# EAGLE design Final Driver Concept (EAGLE 9.5.0)
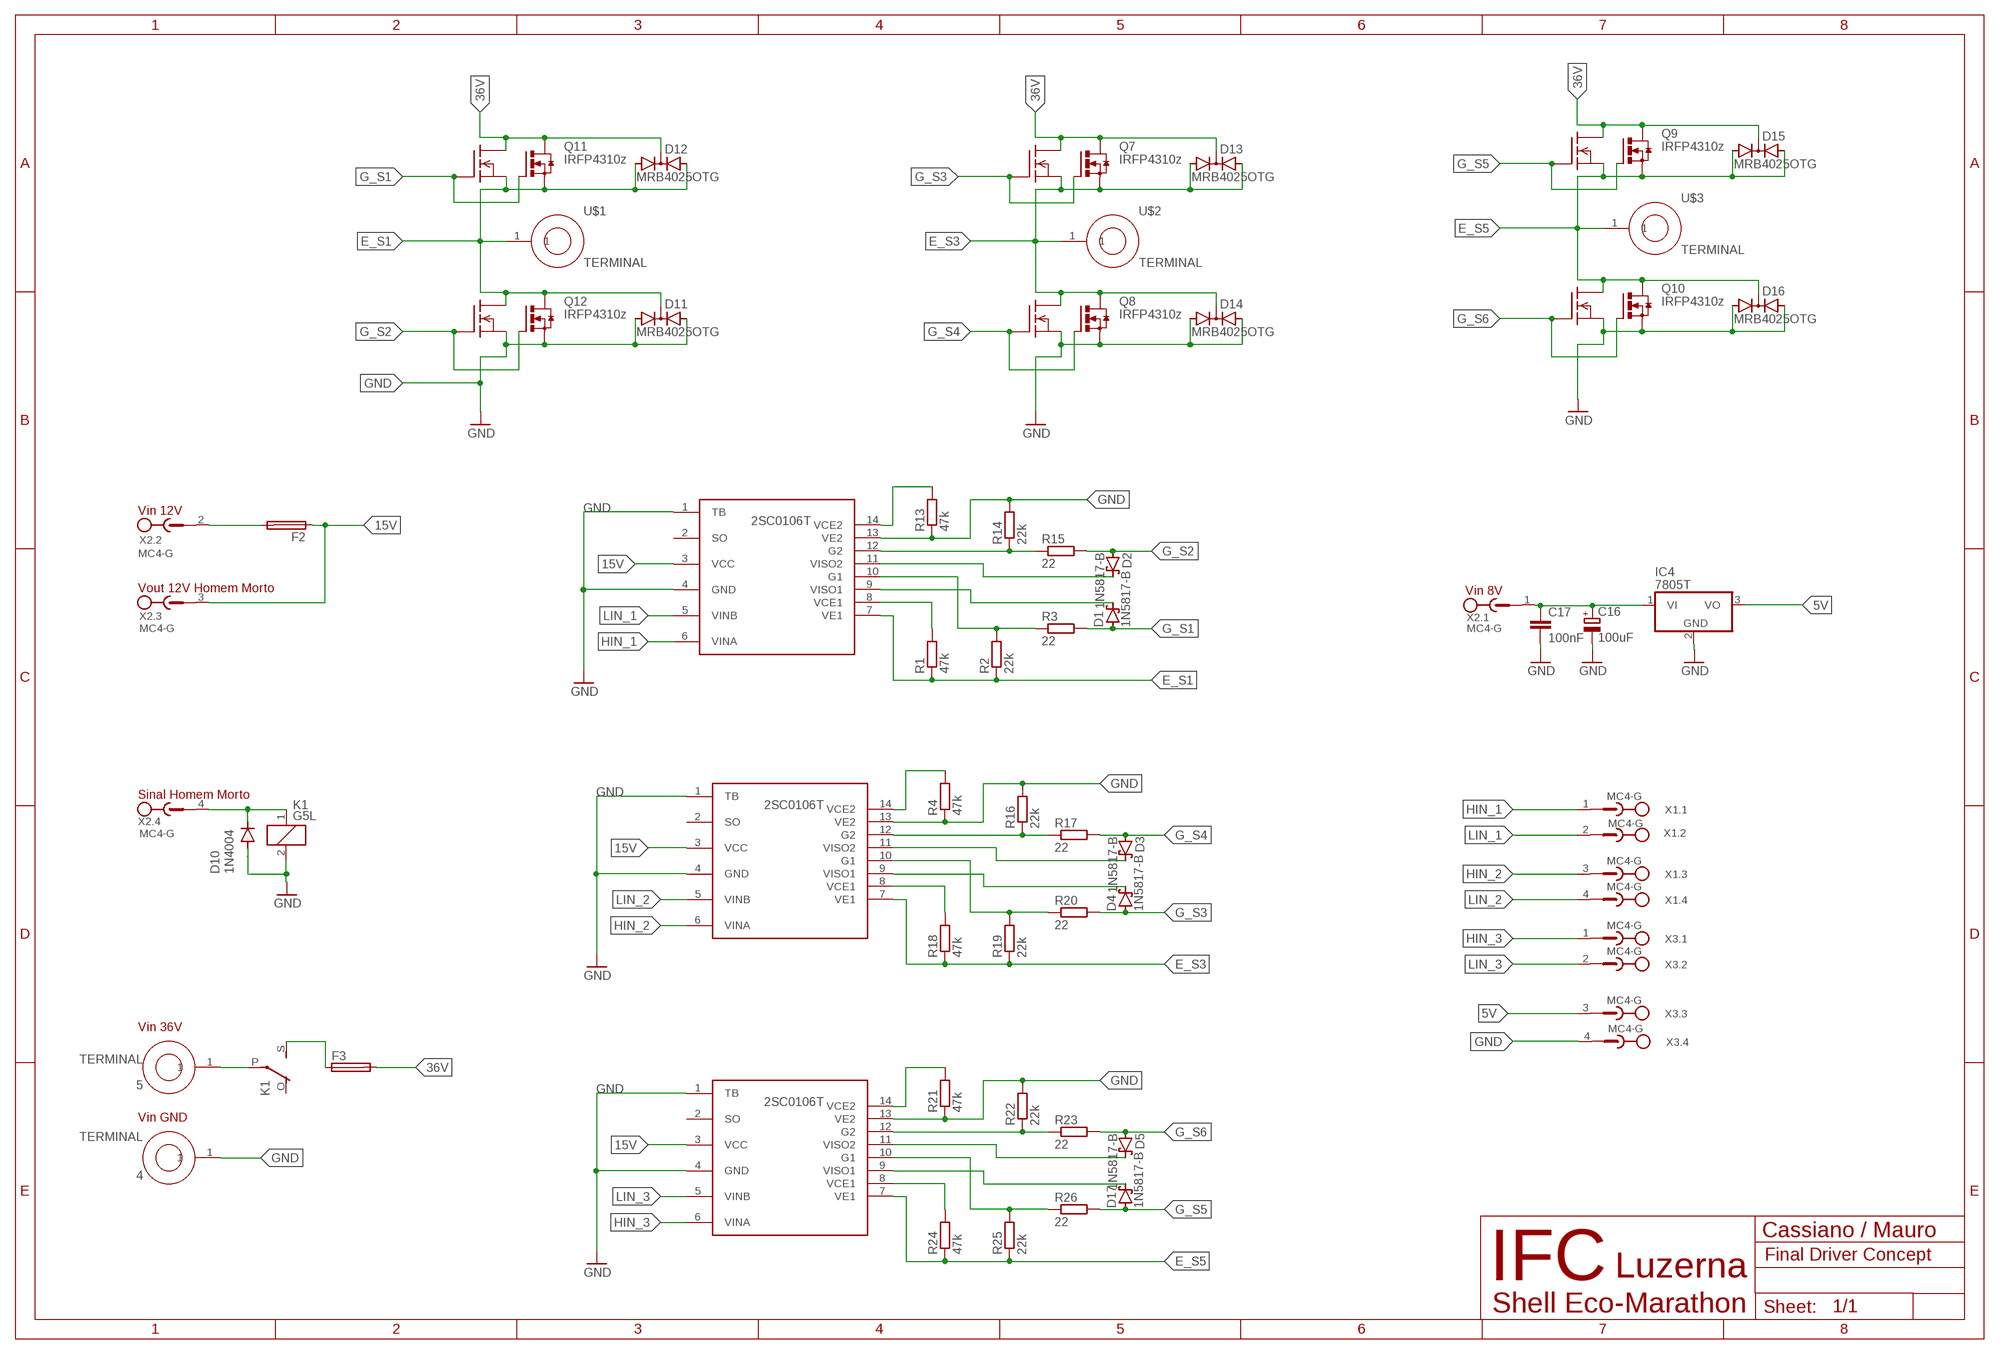
[diagram p0: schematic, sheet 1]

## Parts
4  TERMINAL  [TERMINAL]
5  TERMINAL  [TERMINAL]
C16  100uF  CPOL-EUE2.5-7  [E2,5-7]
C17  100nF  C-EU050-045X075  [C050-045X075]
D1  1N5817-B  [DO41-7.6]
D2  1N5817-B  [DO41-7.6]
D3  1N5817-B  [DO41-7.6]
D4  1N5817-B  [DO41-7.6]
D5  1N5817-B  [DO41-7.6]
D10  1N4004  [DO41-10]
D11  MRB4025OTG  MUR620CT  [TO220AB]
D12  MRB4025OTG  MUR620CT  [TO220AB]
D13  MRB4025OTG  MUR620CT  [TO220AB]
D14  MRB4025OTG  MUR620CT  [TO220AB]
D15  MRB4025OTG  MUR620CT  [TO220AB]
D16  MRB4025OTG  MUR620CT  [TO220AB]
D17  1N5817-B  [DO41-7.6]
F2  SH22,5A  [SH22,5A]
F3  SH22,5A  [SH22,5A]
GATEDRIVER1  2SC0106T1  [2SC0106T]
GATEDRIVER2  2SC0106T1  [2SC0106T]
GATEDRIVER3  2SC0106T1  [2SC0106T]
IC4  7805T  [TO220H]
K1  G5L  [G5LE]
Q1  IRF540  [TO220]
Q2  IRF540  [TO220]
Q3  IRF540  [TO220]
Q4  IRF540  [TO220]
Q5  IRF540  [TO220]
Q6  IRF540  [TO220]
Q7  IRFP4310z  IRFP240-H  [TO247BH]
Q8  IRFP4310z  IRFP240-H  [TO247BH]
Q9  IRFP4310z  IRFP240-H  [TO247BH]
Q10  IRFP4310z  IRFP240-H  [TO247BH]
Q11  IRFP4310z  IRFP240-H  [TO247BH]
Q12  IRFP4310z  IRFP240-H  [TO247BH]
R1  47k  R-EU_0204/7  [0204/7]
R2  22k  R-EU_0204/7  [0204/7]
R3  22  R-EU_0204/7  [0204/7]
R4  47k  R-EU_0204/7  [0204/7]
R13  47k  R-EU_0204/7  [0204/7]
R14  22k  R-EU_0204/7  [0204/7]
R15  22  R-EU_0204/7  [0204/7]
R16  22k  R-EU_0204/7  [0204/7]
R17  22  R-EU_0204/7  [0204/7]
R18  47k  R-EU_0204/7  [0204/7]
R19  22k  R-EU_0204/7  [0204/7]
R20  22  R-EU_0204/7  [0204/7]
R21  47k  R-EU_0204/7  [0204/7]
R22  22k  R-EU_0204/7  [0204/7]
R23  22  R-EU_0204/7  [0204/7]
R24  47k  R-EU_0204/7  [0204/7]
R25  22k  R-EU_0204/7  [0204/7]
R26  22  R-EU_0204/7  [0204/7]
U$1  TERMINAL  [TERMINAL]
U$2  TERMINAL  [TERMINAL]
U$3  TERMINAL  [TERMINAL]
X1  MC4-G  [MC4-G]
X2  MC4-G  [MC4-G]
X3  MC4-G  [MC4-G]

## Nets
5V: IC4.3(VO) X3.3
15V: F2.1 GATEDRIVER1.3(VCC) GATEDRIVER2.3(VCC) GATEDRIVER3.3(VCC) X2.3
36V: D12.C D13.C D15.C F3.2 Q1.2(D) Q3.2(D) Q5.2(D) Q7.D Q9.D Q11.D
E_S1: D11.C D12.A1 D12.A2 GATEDRIVER1.7(VE1) Q1.3(S) Q2.2(D) Q11.S Q12.D R1.1 R2.1 U$1.1
E_S3: D13.A1 D13.A2 D14.C GATEDRIVER2.7(VE1) Q3.3(S) Q4.2(D) Q7.S Q8.D R18.1 R19.1 U$2.1
E_S5: D15.A1 D15.A2 D16.C GATEDRIVER3.7(VE1) Q5.3(S) Q6.2(D) Q9.S Q10.D R24.1 R25.1 U$3.1
G_S1: D1.A Q1.1(G) Q11.G R3.2
G_S2: D2.A Q2.1(G) Q12.G R15.2
G_S3: D4.A Q3.1(G) Q7.G R20.2
G_S4: D3.A Q4.1(G) Q8.G R17.2
G_S5: D17.A Q5.1(G) Q9.G R26.2
G_S6: D5.A Q6.1(G) Q10.G R23.2
GND: 4.1 C16.- C17.2 D10.A D11.A1 D11.A2 D14.A1 D14.A2 D16.A1 D16.A2 GATEDRIVER1.1(TB) GATEDRIVER1.4(GND) GATEDRIVER1.13(VE2) GATEDRIVER2.1(TB) GATEDRIVER2.4(GND) GATEDRIVER2.13(VE2) GATEDRIVER3.1(TB) GATEDRIVER3.4(GND) GATEDRIVER3.13(VE2) IC4.2(GND) K1.2 Q2.3(S) Q4.3(S) Q6.3(S) Q8.S Q10.S Q12.S R4.1 R13.1 R14.2 R16.2 R21.1 R22.2 X3.4
HIN_1: GATEDRIVER1.6(VINA) X1.1
HIN_2: GATEDRIVER2.6(VINA) X1.3
HIN_3: GATEDRIVER3.6(VINA) X3.1
LIN_1: GATEDRIVER1.5(VINB) X1.2
LIN_2: GATEDRIVER2.5(VINB) X1.4
LIN_3: GATEDRIVER3.5(VINB) X3.2
N$1: GATEDRIVER2.14(VCE2) R4.2
N$2: D1.C GATEDRIVER1.9(VISO1)
N$3: F3.1 K1.S(2:S)
N$6: F2.2 X2.2
N$9: C16.+ C17.1 IC4.1(VI) X2.1
N$10: D10.C K1.1 X2.4
N$11: 5.1 K1.P(2:P)
N$12: GATEDRIVER1.14(VCE2) R13.2
N$13: GATEDRIVER1.12(G2) R14.1 R15.1
N$14: GATEDRIVER1.8(VCE1) R1.2
N$15: D2.C GATEDRIVER1.11(VISO2)
N$16: GATEDRIVER1.10(G1) R2.2 R3.1
N$17: GATEDRIVER2.12(G2) R16.1 R17.1
N$18: D3.C GATEDRIVER2.11(VISO2)
N$19: GATEDRIVER2.8(VCE1) R18.2
N$20: D4.C GATEDRIVER2.9(VISO1)
N$21: GATEDRIVER2.10(G1) R19.2 R20.1
N$22: GATEDRIVER3.14(VCE2) R21.2
N$23: GATEDRIVER3.12(G2) R22.1 R23.1
N$24: D5.C GATEDRIVER3.11(VISO2)
N$25: GATEDRIVER3.8(VCE1) R24.2
N$26: D17.C GATEDRIVER3.9(VISO1)
N$27: GATEDRIVER3.10(G1) R25.2 R26.1
Unconnected: GATEDRIVER1.2(SO) GATEDRIVER2.2(SO) GATEDRIVER3.2(SO) K1.O(2:O)

## Notes on the sheet
- Vin 12V
- Vout 12V Homem Morto
- Vin 8V
- Sinal Homem Morto
- Vin 36V
- Vin GND
- Cassiano / Mauro
- IFC | Luzerna
- Shell Eco-Marathon

## Library data of the parts
4 5 U$1-U$3 = ,Kerschbaumer:TERMINAL
C16 = rcl:CPOL-EU: POLARIZED CAPACITOR, European symbol
C17 = rcl:C-EU: CAPACITOR, European symbol
D1-D5 D17 = diode:1N581*: 1.0A SCHOTTKY BARRIER RECTIFIER Source: http://www.diodes.com/datasheets/ds23001.pdf
D10 = diode:1N4004: DIODE general purpose rectifier, 1 A
D11-D16 = diode:MUR620CT: DIODE dual rectifier, 6 A, 200 V, common cathode
F2 F3 = fuse:SH22,5A: FUSE HOLDER grid 22,5mm, isolated cap OGN0031 8201, Schurter (Buerklin); MPN: 0031.7701.11; OC_FARNELL: unknown; OC_NEWARK: 04F1224
GATEDRIVER1-GATEDRIVER3 = 2SC0106T:2SC0106T: Gate Driver Concept 2SC0106T
IC4 = ,RK_outros:78*: Positive VOLTAGE REGULATOR
K1 = relay:G5L: RELAY 1 x switch, 10 A/120 V AC, 8 A/30 V ADC, Omron; OC_FARNELL: unknown; OC_NEWARK: unknown
Q1-Q6 = transistor-fet:IRF540: N-Channel Enhancement MOSFET (HEXFET); 100V; 28A; 0,077Ohm
Q7-Q12 = transistor-power:IRFP240: HEXFET Power MosFet Source: http://www.irf.com/
R1-R4 R13-R26 = rcl:R-EU_: RESISTOR, European symbol
X1-X3 = con-phoenix-381_l:MC4-G: Mini-Combicon 3.81mm horizontal 4-polig MC 1,5/4-G-3,81 Artikel-Nr. 1803293 mit Gegenstecker MC 1,5/4-ST-3,81 Artikel-Nr. 1803594

## Board
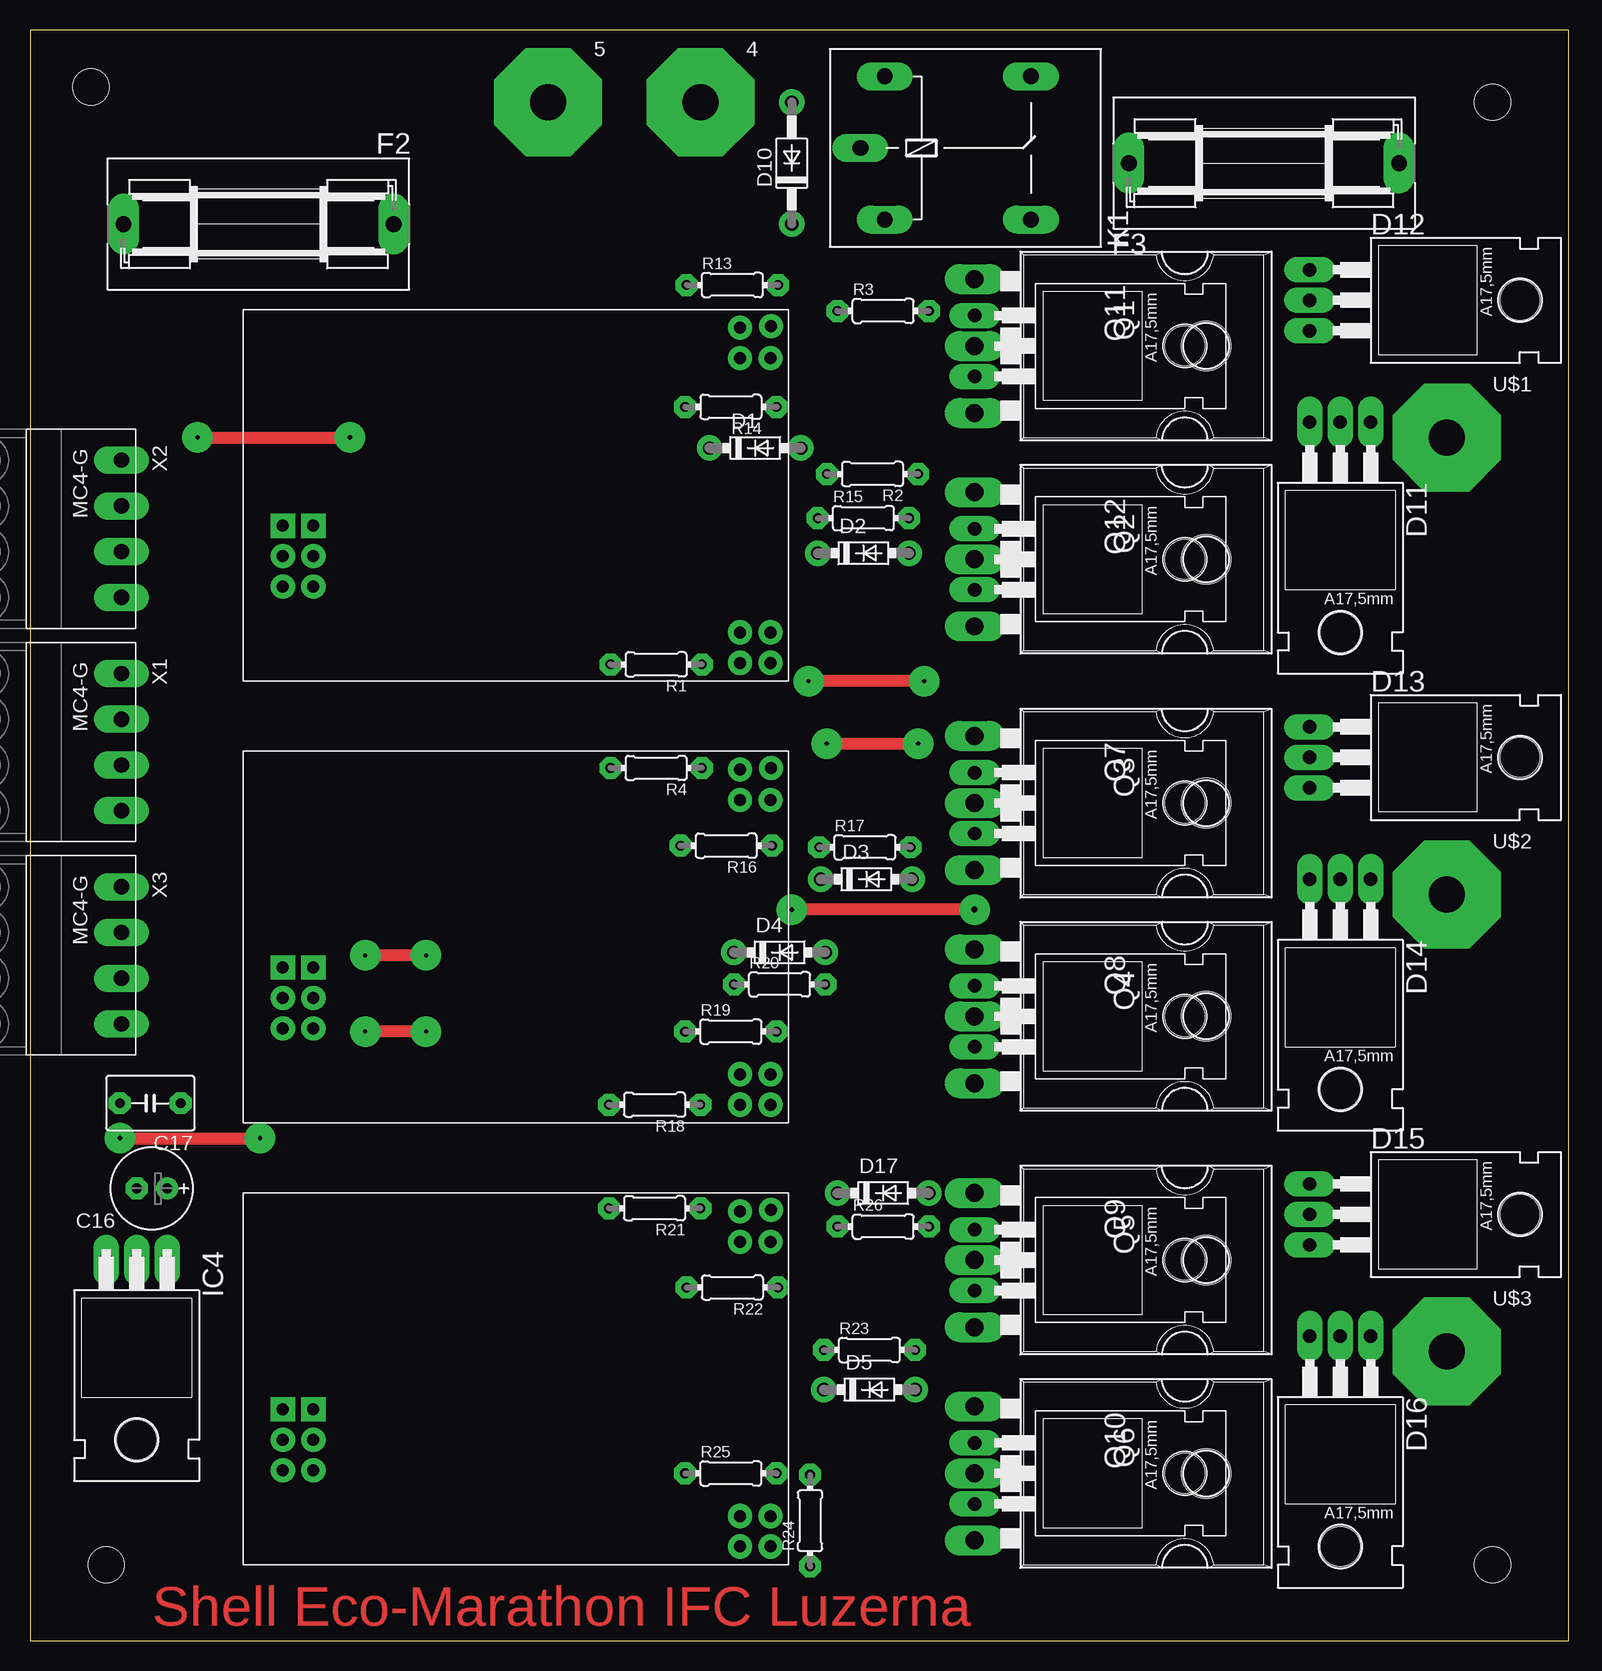
[diagram p1: board, top side]
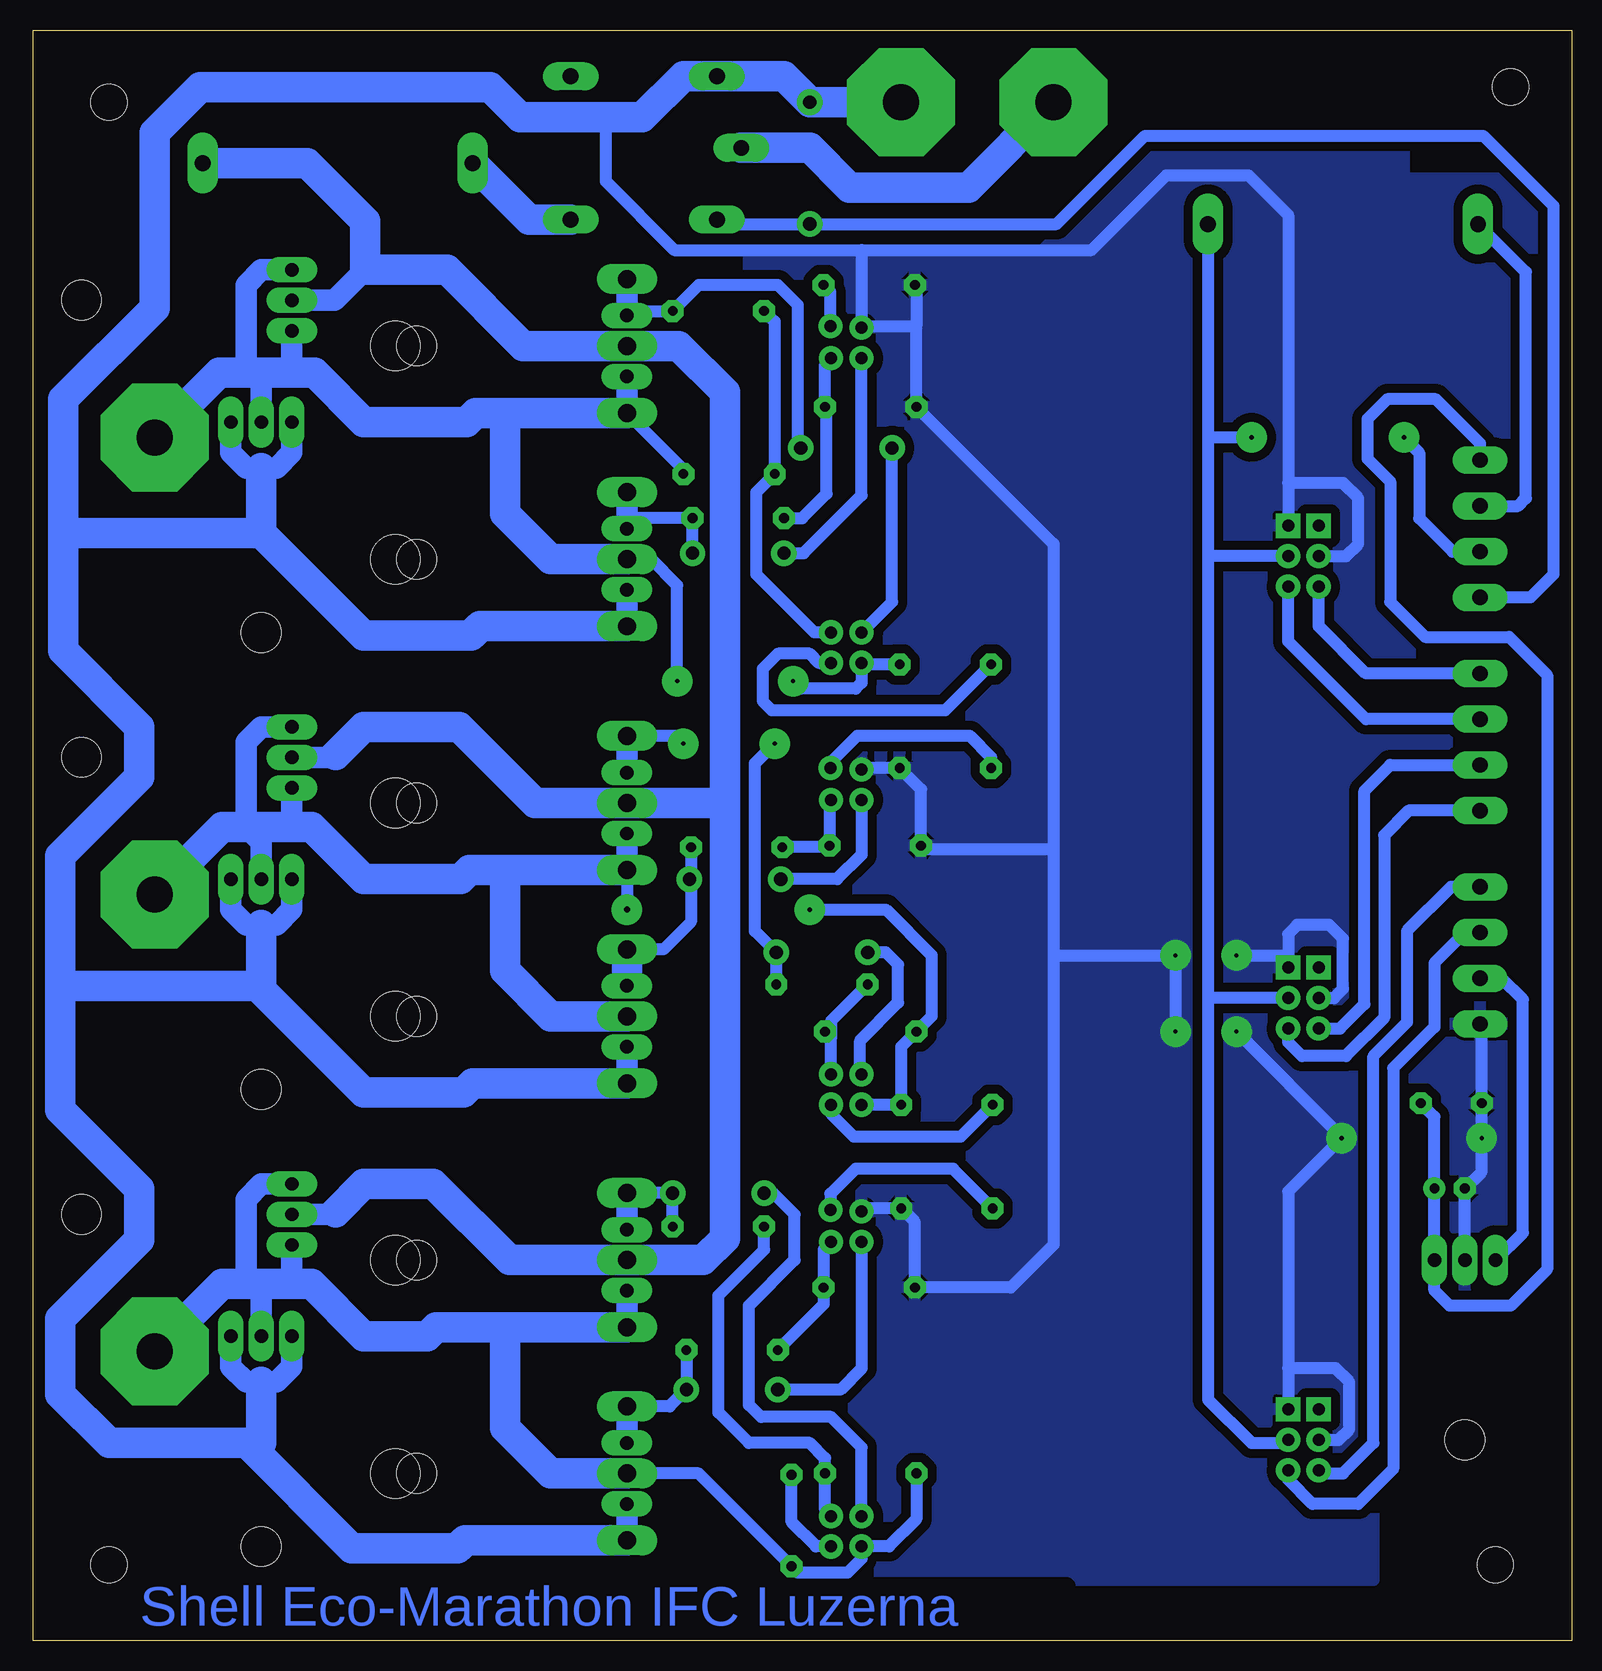
[diagram p2: board, bottom side, seen from below]

Size 128.25 x 134.29 mm. Coordinates in mm from the lower left corner, seen from the top.
Outline: 0,0 128.25,0 128.25,134.29 0,134.29 0,0
Copper layers (1*16): Top 0.035mm / dielectric 1.5mm / Bottom 0.035mm
Design rules "default *": minimum track width 6mil, minimum drill 0.35mm, track to track 30mil, track to pad 30mil, pad to pad 12mil, via to via 12mil, smd to smd 12mil, copper to edge 40mil, drill to drill 6mil, minimum pad ring 20mil, minimum via ring 15mil, stop-mask expansion 4mil, vias tented up to drill 0mil, thermal gap 10mil
Holes 3 mm at 5.08,129.54 121.92,128.27 6.35,6.35 121.92,6.35

### Footprints (pad centres in the part's own frame; a part is rotated, then mirrored left to right if it is on the bottom)
TERMINAL = drill 3 pad 9 octagon: 1 0,0
E2,5-7 = drill 0.813 pad 1.6: + -1.27,0 | drill 0.813 pad 1.6 octagon: - 1.27,0
C050-045X075 = drill 0.813 octagon: 1 -2.54,0; 2 2.54,0
DO41-7.6 = drill 1.1 pad 1.7: A 3.81,0; C -3.81,0
DO41-10 = drill 1.118: A 5.08,0; C -5.08,0
TO220AB = drill 1.118 long: A1 -2.54,-6.35; A2 2.54,-6.35; C 0,-6.35 | hole 3.302: 0,11.176
SH22,5A = drill 1.321 pad 2.54 long: 1 -11.252,0; 2 11.252,0
2SC0106T = drill 1 pad 1.93 square: 1 5.842,12.954; 2 3.302,12.954 | drill 1 pad 1.93: 3 5.842,10.414; 4 3.302,10.414; 5 5.842,7.874; 6 3.302,7.874; 7 41.402,1.524; 8 43.942,1.524; 9 41.402,4.064; 10 43.942,4.064; 11 41.402,26.924; 12 43.942,26.924; 13 41.402,29.464; 14 44.003,29.588
TO220H = drill 1.118 long: 1 -2.54,-10.16; 2 0,-10.16; 3 2.54,-10.16 | hole 3.302: 0,4.826
G5LE = drill 1.321 long: 1 -7.493,-5.969; 2 -7.493,5.969; O 4.699,5.969; P -9.525,0; S 4.699,-5.969
TO220 = drill 1.118 long: 1 -2.54,-6.35; 2 0,-6.35; 3 2.54,-6.35 | hole 3.302: 0,11.176
TO247BH = drill 1.499 long: D 0,-10.16; G -5.588,-10.16; S 5.588,-10.16 | hole 4.115: 0,9.144
0204/7 = drill 0.813 octagon: 1 -3.81,0; 2 3.81,0
MC4-G = drill 1.27 long: 1 -5.715,0; 2 -1.905,0; 3 1.905,0; 4 5.715,0

### Placement (x,y rotation side)
4  55.88,128.27 0 top
5  43.18,128.27 0 top
C16  10.16,37.72 180 top
C17  10.03,44.83 180 top
D1  60.45,99.44 0 top
D2  69.47,90.68 0 top
D3  69.72,63.5 0 top
D4  62.48,57.4 0 top
D5  69.98,20.96 0 top
D10  63.5,123.19 90 top
D11  109.22,95.25 180 top
D12  113.03,111.76 270 top
D13  113.03,73.66 270 top
D14  109.22,57.15 180 top
D15  113.03,35.56 270 top
D16  109.22,19.05 180 top
D17  71.12,37.34 0 top
F2  19.05,118.11 180 top
F3  102.87,123.19 0 top
GATEDRIVER1  17.78,80.01 0 top
GATEDRIVER2  17.78,43.18 0 top
GATEDRIVER3  17.78,6.35 0 top
IC4  8.89,21.59 180 top
K1  78.74,124.46 0 top
Q1  85.09,107.95 270 top
Q2  85.09,90.17 270 top
Q3  85.09,69.85 270 top
Q4  85.09,52.07 270 top
Q5  85.09,31.75 270 top
Q6  85.09,13.97 270 top
Q7  88.9,69.85 270 top
Q8  88.9,52.07 270 top
Q9  88.9,31.75 270 top
Q10  88.9,13.97 270 top
Q11  88.9,107.95 270 top
Q12  88.9,90.17 270 top
R1  52.2,81.41 180 top
R2  70.23,97.28 180 top
R3  71.12,110.87 0 top
R4  52.2,72.77 180 top
R13  58.55,113.03 0 top
R14  58.42,102.87 180 top
R15  69.47,93.6 0 top
R16  58.04,66.29 180 top
R17  69.6,66.17 0 top
R18  52.07,44.7 180 top
R19  58.42,50.8 0 top
R20  62.48,54.74 0 top
R21  52.07,36.07 180 top
R22  58.55,29.46 180 top
R23  69.98,24.26 0 top
R24  65.02,10.03 90 top
R25  58.42,13.97 0 top
R26  71.12,34.54 0 top
U$1  118.11,100.33 0 top
U$2  118.11,62.23 0 top
U$3  118.11,24.13 0 top
X1  7.62,74.93 270 top
X2  7.62,92.71 270 top
X3  7.62,57.15 270 top

### Tracks (layer width: path | path; a pad name or v marks a point on that pad's centre or on a via)
5V
  Bottom 1.016: IC4.3 4.06,34.04 4.06,53.47 5.84,55.25 X3.3
15V  (via drill 0.35 pad 2.54)
  Top 1.016: v13.97,100.33 v26.67,100.33
  Bottom 1.016: F2.1 30.3,100.33 | 30.3,100.33 30.3,90.17 | 30.3,90.17 30.3,53.59 | 30.3,53.59 30.3,20.14 26.67,16.51 23.88,16.51 GATEDRIVER3.3 | GATEDRIVER1.3 30.05,90.42 30.3,90.17 | GATEDRIVER2.3 30.3,53.59 | X2.3 9.91,90.81 12.7,93.6 12.7,99.06 v13.97,100.33 | v26.67,100.33 30.3,100.33
36V
  Bottom 1.778: 100.58,114.3 103.12,111.76 D12.C | 103.04,73.83 103.21,73.66 D13.C | 103.04,35.73 103.21,35.56 D15.C
  Bottom 2.54: F3.2 105.41,123.19 100.58,118.36 100.58,114.3 93.75,114.3 87.4,107.95 Q11.D 74.42,107.95 70.59,104.12 70.59,69.85 | 103.04,73.83 100.67,76.2 92.73,76.2 86.38,69.85 Q7.D 70.59,69.85 | 103.04,35.73 100.67,38.1 94.89,38.1 88.54,31.75 Q9.D 72.39,31.75 70.59,33.55 70.59,69.85
E_S1  (via drill 0.35 pad 2.54)
  Top 1.016: v74.55,80.01 v64.9,80.01
  Bottom 1.016: Q11.S 74.04,97.66 R2.1 | R1.1 59.05,81.41 GATEDRIVER1.7 59.18,79.88 59.69,79.38 64.26,79.38 v64.9,80.01 | v74.55,80.01 74.55,88.01 76.71,90.17 Q12.D
  Bottom 1.778: 110.49,105.72 110.49,113.03 109.22,114.3 D12.A1 | Q11.S Q1.3 | D12.A2 106.68,105.72 | D11.C 109.22,105.72
  Bottom 2.54: 88.9,102.36 91.35,102.36 92.11,101.6 100.67,101.6 104.79,105.72 106.68,105.72 109.22,105.72 110.49,105.72 112.73,105.72 U$1.1 | 88.9,102.36 Q11.S | Q12.D 85.09,90.17 88.9,93.98 88.9,102.36
E_S3  (via drill 0.35 pad 2.54, 0.5 pad 2.54)
  Top 1.016: v78.74,60.96 v63.5,60.96
  Bottom 1.016: Q7.S v78.74,60.96 | GATEDRIVER2.7 R18.1 55.88,49.53 R19.1 53.34,52.07 53.34,57.15 57.15,60.96 v63.5,60.96
  Bottom 1.778: Q3.3 Q7.S | D13.A2 106.68,67.87 | D13.A1 109.22,76.2 110.49,74.93 110.49,67.87 109.22,66.6 D14.C
  Bottom 2.54: 88.9,64.26 91.86,64.26 92.62,63.5 100.67,63.5 105.04,67.87 106.68,67.87 110.49,67.87 112.47,67.87 U$2.1 | 88.9,64.26 Q7.S | Q8.D 85.09,52.07 88.9,55.88 88.9,64.26
E_S5
  Bottom 1.016: R25.1 54.61,10.16 56.9,7.87 GATEDRIVER3.7 59.18,6.86 60.33,5.72 64.52,5.72 R24.1 72.77,13.97 Q10.D
  Bottom 1.778: 110.49,29.77 110.49,36.83 109.22,38.1 D15.A1 | Q5.3 Q9.S | D16.C 109.22,29.77 | D15.A2 106.68,29.77
  Bottom 2.54: 88.9,26.16 94.65,26.16 95.41,25.4 100.67,25.4 105.04,29.77 106.68,29.77 109.22,29.77 110.49,29.77 112.47,29.77 U$3.1 | 88.9,26.16 Q9.S | Q10.D 85.09,13.97 88.9,17.78 88.9,26.16
G_S1
  Bottom 1.016: Q1.1 78.36,110.87 R3.2 72.77,113.03 66.17,113.03 64.52,111.38 64.52,99.7 D1.A
  Bottom 1.778: Q11.G Q1.1
G_S2
  Bottom 1.016: D2.A R15.2 78.36,93.6 78.74,93.98
  Bottom 1.778: Q12.G 78.74,93.98 Q2.1
G_S3  (via drill 0.35 pad 2.54)
  Top 1.016: v66.42,74.8 v74.04,74.8
  Bottom 1.016: R20.2 D4.A 68.07,59.18 68.07,73.15 v66.42,74.8 | v74.04,74.8 74.68,75.44 Q7.G
  Bottom 1.778: Q7.G Q3.1
G_S4
  Bottom 1.016: D3.A 73.41,63.63 R17.2 73.41,59.94 75.69,57.66 Q8.G | Q4.1 78.74,55.88
  Bottom 2.54: Q8.G 78.74,55.88
G_S5
  Bottom 1.016: Q9.G D17.A R26.2
  Bottom 1.778: Q5.1 Q9.G
G_S6
  Bottom 1.016: R23.2 D5.A 75.18,19.56 Q10.G
  Bottom 1.778: Q10.G Q6.1
GND  (via drill 0.35 pad 2.54)
  Top 1.016: v33.02,57.15 v27.94,57.15 | v7.49,41.91 v19.18,41.91 | v33.02,50.8 v27.94,50.8
  Bottom 1.016: 80.52,127 80.52,121.67 74.8,115.95 59.18,115.95 | 109.22,16.51 110.45,16.51 | 59.18,115.95 GATEDRIVER1.13 59.05,109.6 54.61,109.6 | 54.61,109.6 54.61,112.9 R13.1 | 54.61,109.6 R14.2 43.18,91.44 43.18,66.04 | 43.18,66.04 43.18,57.15 | 43.18,57.15 43.18,33.02 46.74,29.46 R22.2 54.74,34.92 R21.1 58.93,36.07 GATEDRIVER3.13 | 43.18,66.04 53.97,66.04 R16.2 54.23,70.99 R4.1 59.05,72.77 GATEDRIVER2.13 | 59.18,115.95 40,115.95 33.78,122.17 26.92,122.17 23.62,118.87 23.62,96.52 | 23.62,96.52 GATEDRIVER1.1 | GATEDRIVER1.4 18.8,90.42 17.78,91.44 17.78,95.25 19.05,96.52 23.62,96.52 | GATEDRIVER2.4 19.81,53.59 19.05,54.36 19.05,58.55 20.19,59.69 22.86,59.69 23.62,58.93 23.62,57.15 | 23.62,57.15 GATEDRIVER2.1 | IC4.2 C16.- 7.49,39.12 v7.49,41.91 C17.2 7.49,51.31 X3.4 | 43.18,57.15 v33.02,57.15 v33.02,50.8 | v27.94,57.15 23.62,57.15 | GATEDRIVER3.4 19.43,16.76 18.54,17.65 18.54,21.59 19.68,22.73 23.62,22.73 GATEDRIVER3.1 23.62,37.47 v19.18,41.91 19.18,42.04 v27.94,50.8
  Bottom 1.778: Q4.3 Q8.S | Q6.3 Q10.S | D14.A2 106.68,60.96 107.95,59.69 109.22,59.69 110.49,59.69 111.76,60.96 D14.A1 | D16.A2 106.68,22.86 107.95,21.59 109.22,21.59 110.49,21.59 111.76,22.86 D16.A1 | Q2.3 Q12.S | D11.A1 111.76,99.06 110.49,97.79 109.22,97.79 107.95,97.79 106.68,99.06 D11.A2
  Bottom 2.54: 4.1 D10.A 65.66,130.43 K1.2 74.04,130.43 77.47,127 80.52,127 87.63,127 90.17,129.54 114.3,129.54 118.11,125.73 118.11,111.12 125.73,103.5 125.73,92.71 | Q10.S 92.24,8.38 92.87,7.75 101.69,7.75 110.45,16.51 121.92,16.51 125.96,20.55 125.96,26.86 119.38,33.44 119.38,37.68 125.96,44.26 125.96,54.61 | 109.22,21.59 109.22,16.51 | Q8.S 91.6,46.48 92.37,45.72 100.67,45.72 109.22,54.27 | 109.22,59.69 109.22,54.27 | 109.22,92.37 100.67,83.82 91.73,83.82 90.97,84.58 Q12.S | 109.22,97.79 109.22,92.37 | 125.73,92.71 125.73,82.55 119.38,76.2 119.38,72 125.96,65.42 125.96,54.61 | 109.22,54.27 109.56,54.61 125.96,54.61 | 109.22,92.37 125.39,92.37 125.73,92.71
  pour Bottom: 2.54,12.7 15.24,12.7 16.51,11.43 16.51,5.08 68.58,5.08 68.58,115.57 44.45,115.57 33.02,127 13.97,127 13.97,121.92 2.54,121.92
HIN_1
  Bottom 1.016: X1.1 17.14,80.65 21.08,84.58 GATEDRIVER1.6
HIN_2
  Bottom 1.016: GATEDRIVER2.6 19.3,51.05 17.27,53.09 17.27,70.87 15.11,73.03 X1.3
HIN_3
  Bottom 1.016: X3.1 10.03,62.86 13.72,59.18 13.72,51.56 16.51,48.77 16.51,16.51 19.05,13.97 20.83,13.97 GATEDRIVER3.6
LIN_1
  Bottom 1.016: X1.2 17.14,76.84 23.62,83.31 GATEDRIVER1.5
LIN_2
  Bottom 1.016: X1.4 13.59,69.22 15.62,67.18 15.62,51.94 18.8,48.77 22.48,48.77 23.62,49.91 GATEDRIVER2.5
LIN_3
  Bottom 1.016: X3.2 8.89,59.06 11.43,56.52 11.43,51.18 14.86,47.75 14.86,14.35 17.78,11.43 21.59,11.43 23.62,13.46 GATEDRIVER3.5
N$1
  Bottom 1.016: R4.2 48.39,73.66 50.17,75.44 59.56,75.44 61.78,73.22 GATEDRIVER2.14
N$2
  Bottom 1.016: GATEDRIVER1.9 56.64,86.61 D1.C
N$3
  Bottom 2.54: K1.S 86.92,118.49 F3.1
N$6
  Bottom 1.016: X2.2 4.44,94.62 3.81,95.25 3.81,114.12 F2.2
N$9
  Bottom 1.016: X2.1 7.62,99.82 11.3,103.51 15.37,103.51 17.02,101.85 17.02,98.55 15.11,96.65 15.11,86.61 12.19,83.69 5.21,83.69 2.03,80.52 2.03,30.99 5.08,27.94 10.16,27.94 11.43,29.21 IC4.1 C16.+ 11.43,43.69 C17.1
N$10
  Bottom 1.016: K1.1 70.87,118.11 D10.C 42.93,118.11 35.56,125.48 7.37,125.48 1.52,119.63 1.52,88.9 3.43,87 X2.4
N$11
  Bottom 2.54: 5.1 50.29,121.16 60.2,121.16 63.5,124.46 K1.P
N$12
  Bottom 1.016: GATEDRIVER1.14 61.78,112.46 R13.2
N$13
  Bottom 1.016: GATEDRIVER1.12 62.23,106.43 R14.1 62.1,102.74 62.1,95.63 64.14,93.6 R15.1
N$14
  Bottom 1.016: GATEDRIVER1.8 62.74,81.53 63.5,82.3 66.17,82.3 67.44,81.03 67.44,78.36 66.67,77.6 52.2,77.6 R1.2
N$15
  Bottom 1.016: GATEDRIVER1.11 59.18,95.5 64.01,90.68 D2.C
N$16
  Bottom 1.016: R3.1 66.42,109.98 R2.2 67.94,95.76 67.94,88.9 63.12,84.07 GATEDRIVER1.10
N$17
  Bottom 1.016: GATEDRIVER2.12 61.85,69.98 R16.1 61.98,66.17 R17.1
N$18
  Bottom 1.016: D3.C 61.21,63.5 59.18,65.53 GATEDRIVER2.11
N$19
  Bottom 1.016: R18.2 50.93,42.04 59.82,42.04 61.72,43.94 GATEDRIVER2.8
N$20
  Bottom 1.016: GATEDRIVER2.9 59.31,47.37 59.31,50.04 56.13,53.21 56.13,56.39 57.15,57.4 D4.C
N$21
  Bottom 1.016: GATEDRIVER2.10 61.72,50.29 | 61.72,50.29 R19.2 | R20.1 61.72,51.69 61.72,50.29
N$22
  Bottom 1.016: R21.2 51.56,39.37 59.69,39.37 61.78,37.28 GATEDRIVER3.14
N$23
  Bottom 1.016: GATEDRIVER3.12 62.36,32.64 R22.1 62.36,28.07 R23.1
N$24
  Bottom 1.016: GATEDRIVER3.11 59.18,22.73 60.96,20.96 D5.C
N$25
  Bottom 1.016: GATEDRIVER3.8 62.99,7.87 65.02,9.91 R24.2
N$26
  Bottom 1.016: GATEDRIVER3.9 59.18,16.13 61.72,18.67 67.56,18.67 68.58,19.69 68.58,27.94 64.77,31.75 64.77,35.56 66.55,37.34 D17.C
N$27
  Bottom 1.016: GATEDRIVER3.10 62.23,10.92 R25.2 62.23,15.24 63.5,16.51 68.58,16.51 71.12,19.05 71.12,28.8 67.31,32.61 R26.1

### Text on the board
Top: Shell Eco-Marathon IFC Luzerna
Bottom: Shell Eco-Marathon IFC Luzerna